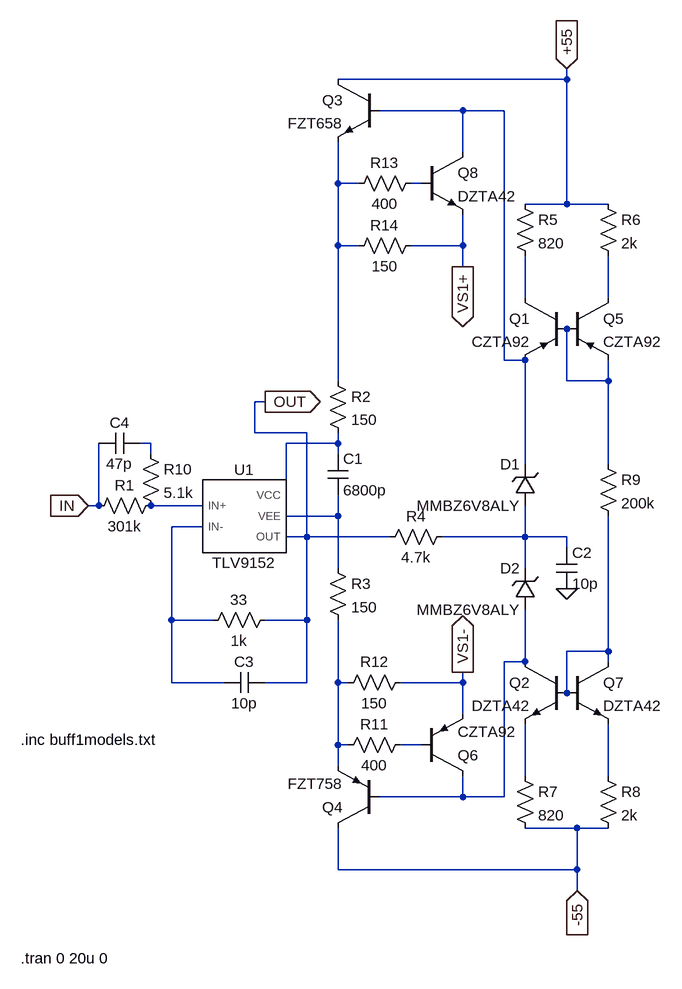
[diagram p0: schematic Draft1.asc]
Draft1.asc, the LTspice schematic file:
Version 4
SHEET 1 1440 892
WIRE 688 -496 688 -512
WIRE 688 -496 336 -496
WIRE 528 -448 400 -448
WIRE 592 -448 528 -448
WIRE 528 -384 528 -448
WIRE 336 -336 336 -400
WIRE 368 -336 336 -336
WIRE 464 -336 448 -336
WIRE 688 -304 688 -496
WIRE 688 -304 624 -304
WIRE 752 -304 688 -304
WIRE 336 -240 336 -336
WIRE 368 -240 336 -240
WIRE 528 -240 528 -288
WIRE 528 -240 448 -240
WIRE 528 -208 528 -240
WIRE 624 -160 624 -224
WIRE 752 -160 752 -224
WIRE 592 -64 592 -448
WIRE 624 -64 592 -64
WIRE 336 -32 336 -240
WIRE 688 -32 688 -112
WIRE 752 -32 752 -64
WIRE 752 -32 688 -32
WIRE 224 0 208 0
WIRE 208 48 208 0
WIRE 288 48 208 48
WIRE 48 64 32 64
WIRE 336 64 336 48
WIRE 336 64 256 64
WIRE 48 80 48 64
WIRE 336 80 336 64
WIRE 624 96 624 -64
WIRE 752 96 752 -32
WIRE 256 144 256 64
WIRE -32 160 -32 64
WIRE -32 160 -48 160
WIRE 128 160 48 160
WIRE 336 176 336 144
WIRE 336 176 256 176
WIRE 128 192 80 192
WIRE 288 208 288 48
WIRE 288 208 256 208
WIRE 416 208 288 208
WIRE 624 208 624 160
WIRE 624 208 496 208
WIRE 688 208 624 208
WIRE 688 224 688 208
WIRE 336 256 336 176
WIRE 624 256 624 208
WIRE 80 336 80 192
WIRE 144 336 80 336
WIRE 288 336 288 208
WIRE 288 336 224 336
WIRE 752 384 752 176
WIRE 752 384 688 384
WIRE 624 400 624 320
WIRE 624 400 592 400
WIRE 752 400 752 384
WIRE 80 432 80 336
WIRE 160 432 80 432
WIRE 288 432 288 336
WIRE 288 432 224 432
WIRE 336 432 336 336
WIRE 352 432 336 432
WIRE 528 432 528 416
WIRE 528 432 432 432
WIRE 688 448 688 384
WIRE 528 480 528 432
WIRE 336 528 336 432
WIRE 352 528 336 528
WIRE 464 528 432 528
WIRE 336 560 336 528
WIRE 624 576 624 496
WIRE 752 576 752 496
WIRE 528 608 528 576
WIRE 528 608 400 608
WIRE 592 608 592 400
WIRE 592 608 528 608
WIRE 704 656 624 656
WIRE 752 656 704 656
WIRE 336 720 336 656
WIRE 704 720 704 656
WIRE 704 720 336 720
WIRE 704 752 704 720
FLAG 688 288 0
FLAG -48 160 IN
IOPIN -48 160 In
FLAG 224 0 OUT
IOPIN 224 0 Out
FLAG 688 -512 +55
IOPIN 688 -512 In
FLAG 704 752 -55
IOPIN 704 752 In
FLAG 528 416 VS1-
IOPIN 528 416 Out
FLAG 528 -208 VS1+
IOPIN 528 -208 Out
SYMBOL TLV9152 192 176 R0
SYMATTR InstName U1
SYMBOL res 320 -48 R0
SYMATTR InstName R2
SYMATTR Value 150
SYMBOL res 320 240 R0
SYMATTR InstName R3
SYMATTR Value 150
SYMBOL res 512 192 R90
WINDOW 0 0 56 VBottom 2
WINDOW 3 32 56 VTop 2
SYMATTR InstName R4
SYMATTR Value 4.7k
SYMBOL res 608 -320 R0
SYMATTR InstName R5
SYMATTR Value 820
SYMBOL res 736 -320 R0
SYMATTR InstName R6
SYMATTR Value 2k
SYMBOL res 608 560 R0
SYMATTR InstName R7
SYMATTR Value 820
SYMBOL res 736 560 R0
SYMATTR InstName R8
SYMATTR Value 2k
SYMBOL res 736 80 R0
SYMATTR InstName R9
SYMATTR Value 200k
SYMBOL res 240 320 R90
WINDOW 0 0 56 VBottom 2
WINDOW 3 32 56 VTop 2
SYMATTR InstName 33
SYMATTR Value 1k
SYMBOL cap 320 80 R0
SYMATTR InstName C1
SYMATTR Value 6800p
SYMBOL zener 640 160 R180
WINDOW 0 24 64 Left 2
WINDOW 3 24 0 Left 2
SYMATTR InstName D1
SYMATTR Value MMBZ6V8ALY
SYMBOL zener 640 320 R180
WINDOW 0 24 64 Left 2
WINDOW 3 24 0 Left 2
SYMATTR InstName D2
SYMATTR Value MMBZ6V8ALY
SYMBOL cap 672 224 R0
SYMATTR InstName C2
SYMATTR Value 10p
SYMBOL npn 688 400 R0
SYMATTR InstName Q7
SYMATTR Value DZTA42
SYMBOL npn 688 400 M0
SYMATTR InstName Q2
SYMATTR Value DZTA42
SYMBOL npn 400 -496 M0
SYMATTR InstName Q3
SYMATTR Value FZT658
SYMBOL pnp 688 -160 M0
SYMATTR InstName Q1
SYMATTR Value CZTA92
SYMBOL pnp 688 -160 R0
SYMATTR InstName Q5
SYMATTR Value CZTA92
SYMBOL pnp 400 656 R180
SYMATTR InstName Q4
SYMATTR Value FZT758
SYMBOL res 64 144 R90
WINDOW 0 0 56 VBottom 2
WINDOW 3 32 56 VTop 2
SYMATTR InstName R1
SYMATTR Value 301k
SYMBOL pnp 464 576 M180
SYMATTR InstName Q6
SYMATTR Value CZTA92
SYMBOL npn 464 -384 R0
SYMATTR InstName Q8
SYMATTR Value DZTA42
SYMBOL res 448 512 R90
WINDOW 0 0 56 VBottom 2
WINDOW 3 32 56 VTop 2
SYMATTR InstName R11
SYMATTR Value 400
SYMBOL res 448 416 R90
WINDOW 0 0 56 VBottom 2
WINDOW 3 32 56 VTop 2
SYMATTR InstName R12
SYMATTR Value 150
SYMBOL res 464 -352 R90
WINDOW 0 0 56 VBottom 2
WINDOW 3 32 56 VTop 2
SYMATTR InstName R13
SYMATTR Value 400
SYMBOL res 464 -256 R90
WINDOW 0 0 56 VBottom 2
WINDOW 3 32 56 VTop 2
SYMATTR InstName R14
SYMATTR Value 150
SYMBOL cap 224 416 R90
WINDOW 0 0 32 VBottom 2
WINDOW 3 32 32 VTop 2
SYMATTR InstName C3
SYMATTR Value 10p
SYMBOL cap 32 48 R90
WINDOW 0 0 32 VBottom 2
WINDOW 3 32 32 VTop 2
SYMATTR InstName C4
SYMATTR Value 47p
SYMBOL res 32 64 R0
SYMATTR InstName R10
SYMATTR Value 5.1k
TEXT -152 520 Left 2 !.inc buff1models.txt
TEXT -152 856 Left 2 !.tran 0 20u 0

The netlist it stands for:
* Draft1.asc
XU1 N009 N011 N008 N010 OUT TLV9152  ; pins IN+ IN- VCC VEE OUT
R2 N002 N008 150
R3 N010 N015 150
R4 N012 OUT 4.7k
R5 +55 N004 820
R6 +55 N005 2k
R7 N017 -55 820
R8 N018 -55 2k
R9 N006 N013 200k
R§33 OUT N011 1k
C1 N008 N010 6800p
D1 N012 N001 MMBZ6V8ALY
D2 N014 N012 MMBZ6V8ALY
C2 N012 0 10p
Q7 N013 N013 N018 0 DZTA42
Q2 N014 N013 N017 0 DZTA42
Q3 +55 N001 N002 0 FZT658
Q1 N004 N006 N001 0 CZTA92
Q5 N005 N006 N006 0 CZTA92
Q4 -55 N014 N015 0 FZT758
R1 N009 IN 301k
Q6 N014 N016 VS1- 0 CZTA92
Q8 N001 N003 VS1+ 0 DZTA42
R11 N016 N015 400
R12 VS1- N015 150
R13 N003 N002 400
R14 VS1+ N002 150
C3 OUT N011 10p
C4 N007 IN 47p
R10 N007 N009 5.1k
.model D D
.lib standard.dio
.model NPN NPN
.model PNP PNP
.lib standard.bjt
.inc buff1models.txt
.tran 0 20u 0
.lib .\tlv9152.lib
.backanno
.end